# EAGLE design SparkFun_Optical_Tracking_Odometry_Sensor (EAGLE 9.6.2)
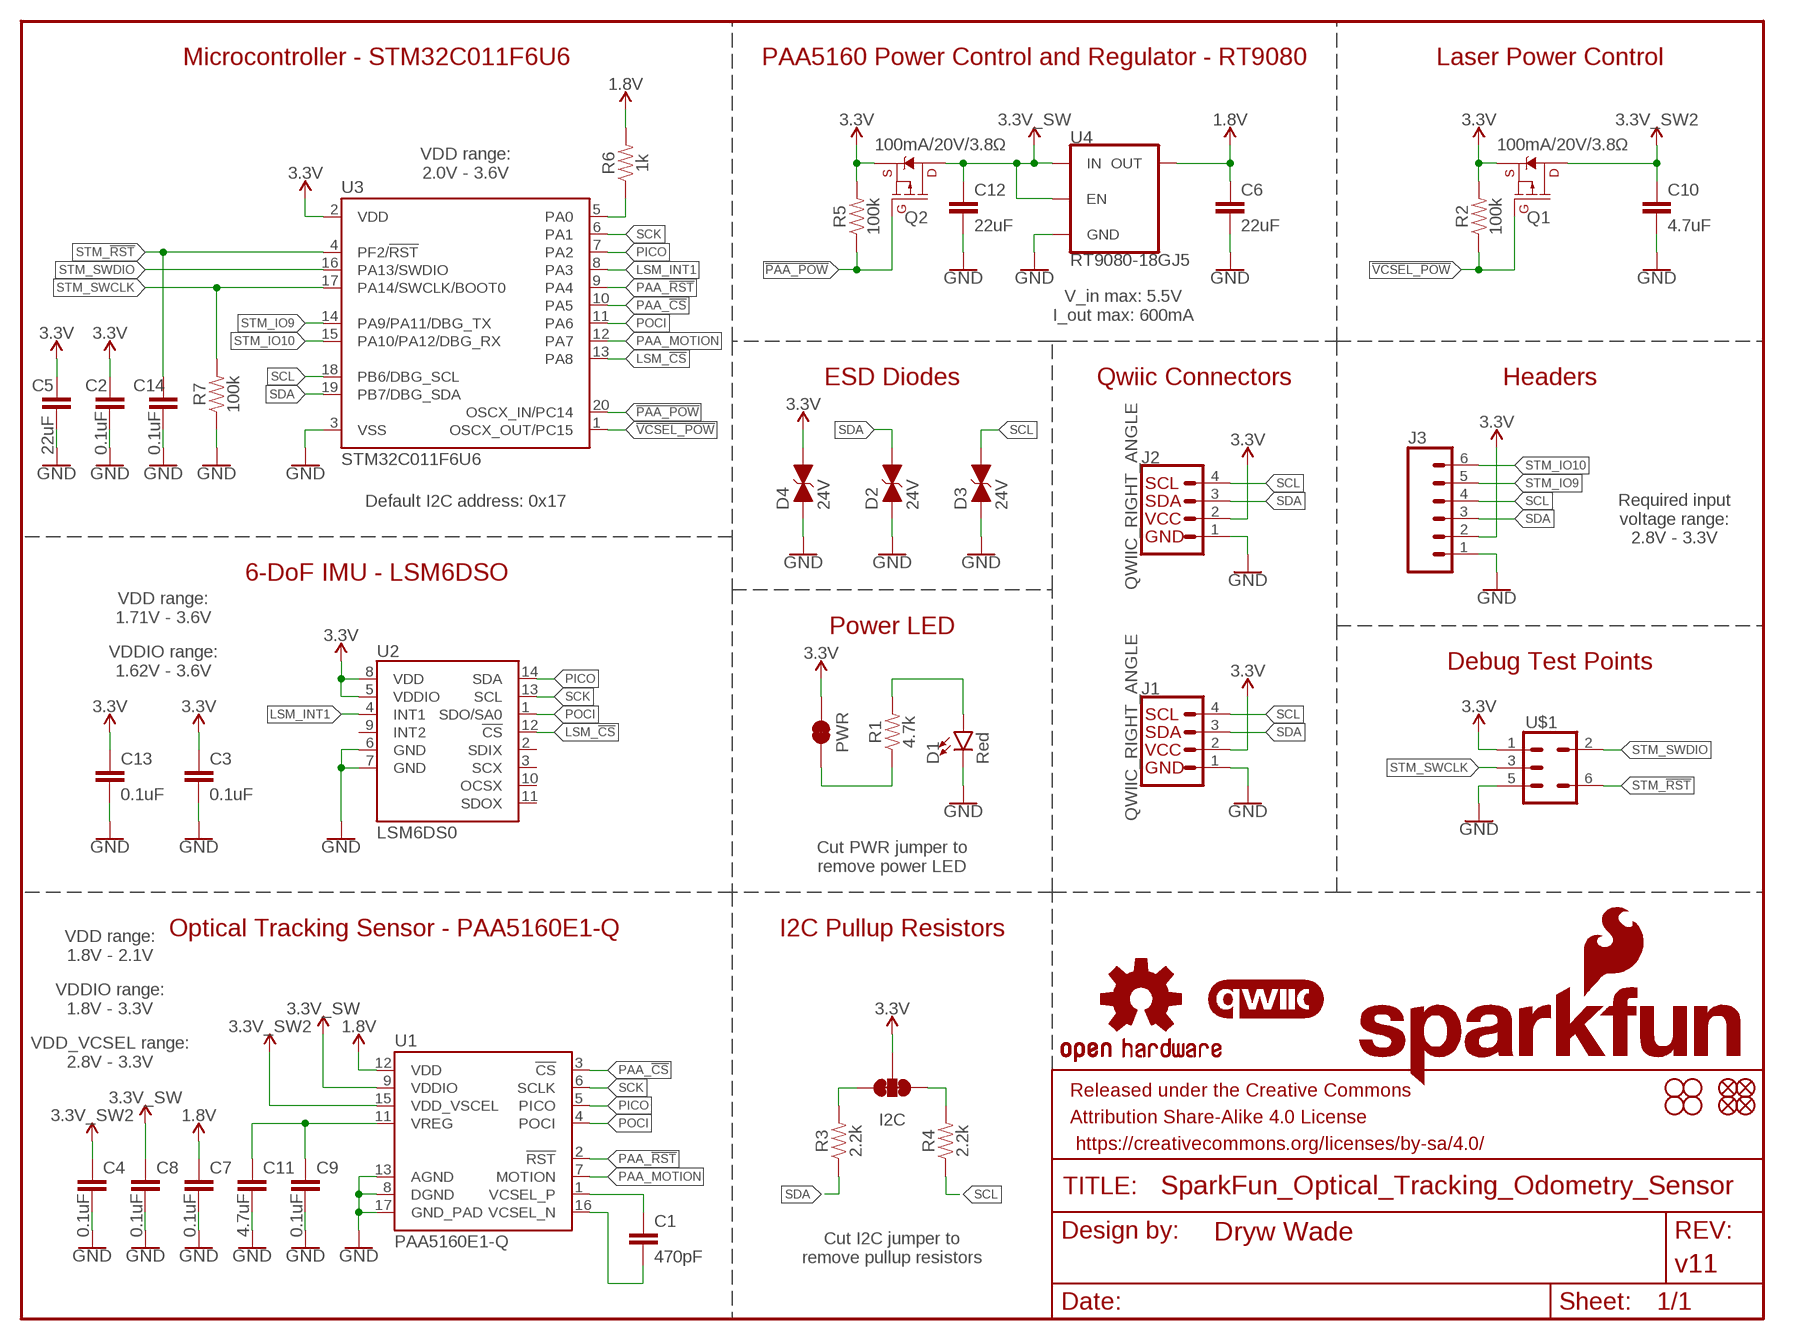
[diagram p0: schematic, sheet 1]

## Parts
C1  470pF  470PF-0603-50V-5%  [0603]
C2  0.1uF  0.1UF-0603-25V-(+80/-20%)  [0603]
C3  0.1uF  0.1UF-0603-25V-(+80/-20%)  [0603]
C4  0.1uF  0.1UF-0603-25V-(+80/-20%)  [0603]
C5  22uF  22UF-0603-6.3V-20%  [0603]
C6  22uF  22UF-0603-6.3V-20%  [0603]
C7  0.1uF  0.1UF-0603-25V-(+80/-20%)  [0603]
C8  0.1uF  0.1UF-0603-25V-(+80/-20%)  [0603]
C9  0.1uF  0.1UF-0603-25V-(+80/-20%)  [0603]
C10  4.7uF  4.7UF-0603-6.3V-(10%)  [0603]
C11  4.7uF  4.7UF-0603-6.3V-(10%)  [0603]
C12  22uF  22UF-0603-6.3V-20%  [0603]
C13  0.1uF  0.1UF-0603-25V-(+80/-20%)  [0603]
C14  0.1uF  0.1UF-0603-25V-(+80/-20%)  [0603]
D1  Red  LED-RED_0603-KB  [LED-0603]
D2  24V  DIODE_TVS  [0603]
D3  24V  DIODE_TVS  [0603]
D4  24V  DIODE_TVS  [0603]
FD1  FIDUCIAL1X2  [FIDUCIAL-1X2]
FD2  FIDUCIAL1X2  [FIDUCIAL-1X2]
FD3  FIDUCIAL1X2  [FIDUCIAL-1X2]
FD4  FIDUCIAL1X2  [FIDUCIAL-1X2]
FRAME1  FRAME-LETTER  [CREATIVE_COMMONS]
H1  STAND-OFF  [STAND-OFF]
H2  STAND-OFF  [STAND-OFF]
H3  STAND-OFF  [STAND-OFF]
H4  STAND-OFF  [STAND-OFF]
I2C  JUMPER-SMT_3_2-NC_TRACE_SILK  [SMT-JUMPER_3_2-NC_TRACE_SILK]
J1  QWIIC_RIGHT_ANGLE  QWIIC_CONNECTORJS-1MM  [JST04_1MM_RA]
J2  QWIIC_RIGHT_ANGLE  QWIIC_CONNECTORJS-1MM  [JST04_1MM_RA]
J3  CONN_06NO_SILK_NO_POP  [1X06_NO_SILK]
LOGO1  OSHW-LOGOS  [OSHW-LOGO-S]
LOGO2  QWIIC_LOGO_5MM  [QWIIC_5MM]
LOGO3  SFE_LOGO_NAME_FLAME.1_INCH  [SFE_LOGO_NAME_FLAME_.1]
PWR  JUMPER-SMT_2_NC_TRACE_SILK  [SMT-JUMPER_2_NC_TRACE_SILK]
Q1  100mA/20V/3.8Ω  MOSFET_PCH-RE1C001ZPTL  [SOT-416FL]
Q2  100mA/20V/3.8Ω  MOSFET_PCH-RE1C001ZPTL  [SOT-416FL]
R1  4.7k  4.7KOHM-0603-1/10W-1%  [0603]
R2  100k  100KOHM-0603-1/10W-1%  [0603]
R3  2.2k  2.2KOHM-0603-1/10W-1%  [0603]
R4  2.2k  2.2KOHM-0603-1/10W-1%  [0603]
R5  100k  100KOHM-0603-1/10W-1%  [0603]
R6  1k  1KOHM-0603-1/10W-1%  [0603]
R7  100k  100KOHM-0603-1/10W-1%  [0603]
U1  PAA5160E1-Q  [PAA5160E1-Q]
U2  LSM6DS0  LSM6DSO  [LGA14L]
U3  STM32C011F6U6  [STM32C011F6U6]
U4  RT9080-18GJ5  V_REG_RT9080-18GJ5  [SOT23-5]
U$1  SWD-5PIN  [PAD_05_03X2_TP_NO4]

## Nets
1.8V: C6.1 C7.1 R6.2 U1.12(VDD) U4.5(OUT)
3.3V: C2.1 C3.1 C5.1 C13.1 D4.2(C) I2C.2 J1.2 J2.2 J3.2 PWR.2 Q1.2(S) Q2.2(S) R2.2 R5.2 U2.5(VDDIO) U2.8(VDD) U3.2(VDD) U$1.1
3.3V_SW: C8.1 C12.1 Q2.3(D) U1.9(VDDIO) U4.1(IN) U4.3(EN)
3.3V_SW2: C4.1 C10.1 Q1.3(D) U1.15(VDD_VSCEL)
!PAA_POW!: Q2.1(G) R5.1 U3.20(OSCX_IN/PC14)
!VCSEL_POW!: Q1.1(G) R2.1 U3.1(OSCX_OUT/PC15)
GND: C2.2 C3.2 C4.2 C5.2 C6.2 C7.2 C8.2 C9.2 C10.2 C11.2 C12.2 C13.2 C14.2 D1.C D2.1(A) D3.1(A) D4.1(A) J1.1 J2.1 J3.1 R7.1 U1.8(DGND) U1.13(AGND) U1.17(GND_PAD) U2.6(GND) U2.7(GND) U3.3(VSS) U4.2(GND) U$1.5
LSM_!CS!: U2.12(!CS!) U3.13(PA8)
LSM_INT1: U2.4(INT1) U3.8(PA3)
N$1: PWR.1 R1.1
N$2: D1.A R1.2
N$3: C1.1 U1.1(VCSEL_P)
N$4: C1.2 U1.16(VCSEL_N)
N$5: I2C.3 R3.2
N$6: I2C.1 R4.2
N$7: C9.1 C11.1 U1.11(VREG)
N$8: R6.1 U3.5(PA0)
PAA_!CS!: U1.3(!CS!) U3.10(PA5)
PAA_!RST!: U1.2(!RST!) U3.9(PA4)
PAA_MOTION: U1.7(MOTION) U3.12(PA7)
PICO: U1.5(PICO) U2.14(SDA) U3.7(PA2)
POCI: U1.4(POCI) U2.1(SDO/SA0) U3.11(PA6)
SCK: U1.6(SCLK) U2.13(SCL) U3.6(PA1)
SCL: D3.2(C) J1.4 J2.4 J3.4 R4.1 U3.18(PB6/DBG_SCL)
SDA: D2.2(C) J1.3 J2.3 J3.3 R3.1 U3.19(PB7/DBG_SDA)
STM_!RST!: C14.1 U3.4(PF2/!RST!) U$1.6
STM_IO9: J3.5 U3.14(PA9/PA11/DBG_TX)
STM_IO10: J3.6 U3.15(PA10/PA12/DBG_RX)
STM_SWCLK: R7.2 U3.17(PA14/SWCLK/BOOT0) U$1.3
STM_SWDIO: U3.16(PA13/SWDIO) U$1.2
Unconnected: U2.2(SDIX) U2.3(SCX) U2.9(INT2) U2.10(OCSX) U2.11(SDOX)

## Notes on the sheet
- Microcontroller - STM32C011F6U6 | PAA5160 Power Control and Regulator - RT9080 | Laser Power Control
- VDD range:
  2.0V - 3.6V
- V_in max: 5.5V
  I_out max: 600mA
- ESD Diodes | Qwiic Connectors | Headers
- Default I2C address: 0x17
- Required input
  voltage range:
  2.8V - 3.3V
- 6-DoF IMU - LSM6DSO
- VDD range:
  1.71V - 3.6V
- Power LED
- VDDIO range:
  1.62V - 3.6V
- Debug Test Points
- Cut PWR jumper to
  remove power LED
- Optical Tracking Sensor - PAA5160E1-Q | I2C Pullup Resistors
- VDD range:
  1.8V - 2.1V
- VDDIO range:
  1.8V - 3.3V
- VDD_VCSEL range:
  2.8V - 3.3V
- Cut I2C jumper to
  remove pullup resistors

## Library data of the parts
C1 = SparkFun-Capacitors:470PF: 470pF ceramic capacitors A capacitor is a passive two-terminal electrical component used to store electrical energy temporarily in an electric field.; PROD_ID: CAP-07884
C2-C4 C7-C9 C13 C14 = SparkFun-Capacitors:0.1UF: 0.1µF ceramic capacitors A capacitor is a passive two-terminal electrical component used to store electrical energy temporarily in an electric field.; PROD_ID: CAP-00810
C5 C6 C12 = SparkFun-Capacitors:22UF: 22µF ceramic capacitors A capacitor is a passive two-terminal electrical component used to store electrical energy temporarily in an electric field.; PROD_ID: CAP-14464
C10 C11 = SparkFun-Capacitors:4.7UF: 4.7µF ceramic capacitors A capacitor is a passive two-terminal electrical component used to store electrical energy temporarily in an electric field.; PROD_ID: CAP-08280
D1 = SparkFun-LED:LED-RED: Red SMD LED Used in manufacturing of most products at SparkFun Packages: 0603 - KB - KingBright (DIO-17976) SMD 0603 package [Datasheet] <https://www.kingbrightusa.com/images/catalog/SPEC/APT1608SURCK.pdf> 0603 - (DIO-00819, has gone EOL) SMD 0603 package 0603 SMART - SMD 0603 SMART package ( more efficient and expensive)[Product Link] <http://www.osram-os.com/Graphics/XPic2/00077099_0.pdf> 1206 - SMD1206 package [Product Link] <https://www.sparkfun.com/datasheets/DevTools/LilyPad/Q150OVS4.pdff> SparkFun Products: Pro Mini 328 -5V <https://www.sparkfun.com/products/821> RedBoard <https://www.sparkfun.com/products/12757> IOIO-OTG <https://www.sparkfun.com/products/13613>; PROD_ID: DIO-17976
D2-D4 = SparkFun-DiscreteSemi:DIODE_TVS; PROD_ID: DIO-14502
FD1-FD4 = SparkFun-Aesthetics:FIDUCIAL: Fiducial Alignment Points Point-of-reference for pick-and-place machines and other optical instruments.
FRAME1 = SparkFun-Aesthetics:FRAME-LETTER: Schematic Frame - Letter Standard 8.5x11 US Letter frame; DESIGNER: Dryw Wade; REV: v11
H1-H4 = SparkFun-Hardware:STAND-OFF: Stand Off Drill holes for mechanically mounting via screws, standoffs, etc. Note: Use the keepout ring to avoid running the screw head into surrounding components. Variant Overviews STAND-OFF - Mechanical footprint for a #4 phillips button head screw. STAND-OFF-TIGHT - Mechanical footprint for a #4 phillips button head screw, Example SparkFun Products Screw - Phillips Head (1/4", 4-40, 10 pack) <https://www.sparkfun.com/products/10453> (PRT-10453) Screw - Phillips Head (1/2", 4-40, 10 pack) <https://www.sparkfun.com/products/10452> (PRT-10452) Screw - Phillips Head (3/4", 4-40, 10 pack) <https://www.sparkfun.com/products/10451> (PRT-10451) Screw - Phillips Head (1", 4-40, 10 pack) <https://www.sparkfun.com/products/10450> (PRT-10450)
I2C = SparkFun-Jumpers:JUMPER-SMT_3_2-NC_TRACE: Normally closed trace jumper (2 of 2 connections) This jumper has a trace between all three pads so they are normally closed (NC). Use a razor knife to open the connection(s). For best results follow the IPC guidelines for cutting traces: Cutout at least 0.063 mm (0.005 in). Remove all loose material to clean up the cut area. Seal the cut with an approved epoxy. Reapply solder to reclose the connection(s).
J1 J2 = SparkFun-Connectors:QWIIC_CONNECTOR: SparkFun I2C Standard Qwiic Connector An SMD 1mm pitch JST connector makes it easy and quick (get it? Qwiic?) to connect I2C devices to each other. The Qwiic system <http://www.sparkfun.com/qwiic> enables fast and solderless connection between popular platforms and various sensors and actuators. We carry 200mm <https://www.sparkfun.com/products/14204>, 100mm <https://www.sparkfun.com/products/14205>, 50mm <https://www.sparkfun.com/products/14206>, and breadboard friendly <https://www.sparkfun.com/products/14207> Qwiic cables. We also offer 10 pcs strips <https://www.sparkfun.com/products/14323> the SMD connectors.; PROD_ID: CONN-13694
J3 = SparkFun-Connectors:CONN_06: Multi connection point. Often used as Generic Header-pin footprint for 0.1 inch spaced/style header connections On any of the 0.1 inch spaced packages, you can populate with these: Break Away Headers - Straight <https://www.sparkfun.com/products/116> (PRT-00116) Break Away Male Headers - Right Angle <https://www.sparkfun.com/products/553> (PRT-00553) Female Headers <https://www.sparkfun.com/products/115> (PRT-00115) Break Away Headers - Machine Pin <https://www.sparkfun.com/products/117> (PRT-00117) Break Away Female Headers - Swiss Machine Pin <https://www.sparkfun.com/products/743> (PRT-00743) Arduino Stackable Header - 6 Pin <https://www.sparkfun.com/products/9280> (PRT-09280) Screw Terminals 2.54mm Pitch (6-Pin) <https://www.sparkfun.com/products/16499> (PRT-16499) For SCREWTERMINALS and SPRING TERMINALS visit here: Screw Terimnals on SparkFun.com <https://www.sparkfun.com/search/results?term=Screw+Terminals> (5mm/3.5mm/2.54mm spacing) This device is also useful as a general connection point to wire up your design to another part of your project. Our various solder wires solder well into these plated through hole pads. Hook-Up Wire - Assortment (Stranded, 22 AWG) <https://www.sparkfun.com/products/11375> (PRT-11375) Hook-Up Wire - Assortment (Solid Core, 22 AWG) <https://www.sparkfun.com/products/11367> (PRT-11367) View the entire wire category on our website here <https://www.sparkfun.com/categories/141>
LOGO1 = SparkFun-Aesthetics:OSHW-LOGO: Open-Source Hardware (OSHW) Logo This logo indicates the piece of hardware it is found on incorporates a OSHW license and/or adheres to the definition of open source hardware found here: http://freedomdefined.org/OSHW
LOGO2 = SparkFun-Aesthetics:QWIIC_LOGO: Qwiic Logos for placement on schematic and PCB. The 5.5mm silk logo is best for placing next to Qwiic connector.
LOGO3 = SparkFun-Aesthetics:SFE_LOGO_NAME_FLAME: SparkFun Font Logo w/ Flame This is the SparkFun full logo. The logo on the schematic will always be the same size; the package variant is the height of the flame part of the logo. Default layer for the logo on the board is tSilk.
PWR = SparkFun-Jumpers:JUMPER-SMT_2_NC_TRACE: Normally closed trace jumper This jumper has a trace between two pads so it's normally closed (NC). Use a razor knife to open the connection. For best results follow the IPC guidelines for cutting traces: Cutout at least 0.063 mm (0.005 in). Remove all loose material to clean up the cut area. Seal the cut with an approved epoxy. Reapply solder to reclose the connection.
Q1 Q2 = SparkFun-DiscreteSemi:MOSFET_PCH: P-channel MOSFETs Voltage controlled devices that allow control of high current outputs. SparkFun Products: SparkFun ESP32 Thing <https://www.sparkfun.com/products/13907> SparkFun ESP8266 Thing <https://www.sparkfun.com/products/13231> SparkFun Pi Servo HAT V2 <https://www.sparkfun.com/products/15316> DMG2305UX-7 (20V/4.2A/SOT23-3); PROD_ID: TRANS-15421
R1 = SparkFun-Resistors:4.7KOHM: 4.7kΩ resistor A resistor is a passive two-terminal electrical component that implements electrical resistance as a circuit element. Resistors act to reduce current flow, and, at the same time, act to lower voltage levels within circuits. - Wikipedia; PROD_ID: RES-07857
R2 R5 R7 = SparkFun-Resistors:100KOHM: 100kΩ resistor A resistor is a passive two-terminal electrical component that implements electrical resistance as a circuit element. Resistors act to reduce current flow, and, at the same time, act to lower voltage levels within circuits. - Wikipedia; PROD_ID: RES-07828
R3 R4 = SparkFun-Resistors:2.2KOHM: 2.2kΩ resistor A resistor is a passive two-terminal electrical component that implements electrical resistance as a circuit element. Resistors act to reduce current flow, and, at the same time, act to lower voltage levels within circuits. - Wikipedia; PROD_ID: RES-08272
R6 = SparkFun-Resistors:1KOHM: 1kΩ resistor A resistor is a passive two-terminal electrical component that implements electrical resistance as a circuit element. Resistors act to reduce current flow, and, at the same time, act to lower voltage levels within circuits. - Wikipedia; PROD_ID: RES-07856
U1 = Optical_Tracking_Odometry_Sensor:PAA5160E1-Q; PROD_ID: IC-21320
U2 = SparkFun-Sensors:LSM6DSO: The LSM6DSO is a system-in-package featuring a high-performance 3-axis digital accelerometer and 3-axis digital gyroscope.; PROD_ID: IC-15837
U3 = Optical_Tracking_Odometry_Sensor:STM32C011F6U6; PROD_ID: IC-21321
U4 = SparkFun-IC-Power:V_REG_RT9080-18GJ5: RT9080-18GJ5 Low-Dropout Linear Regulator The RT9080 is a low-dropout (LDO) voltage regulators with enable function that operates from 1.2V to 5.5V. It provides up to 600mA of output current and offers low-power operation in miniaturized packaging. The features of low quiescent current as low as 2μA and almost zero disable current is ideal for powering the battery equipment to a longer service life. The RT9080 is stable with the ceramic output capacitor over its wide input range from 1.2V to 5.5V and the entire range of output load current (0mA to 600mA). The output for this LDO is 1.8V.; PROD_ID: VREG-21045
U$1 = SparkFun-Connectors:SWD-5PIN: 5-pin SWD connector Test-point based header for SWD. Pin 1 - PWR Pin 2 - SWDIO Pin 3 - SWCLK Pin 4 - NC Pin 5 - GND Pin 6 - RESET

## Board
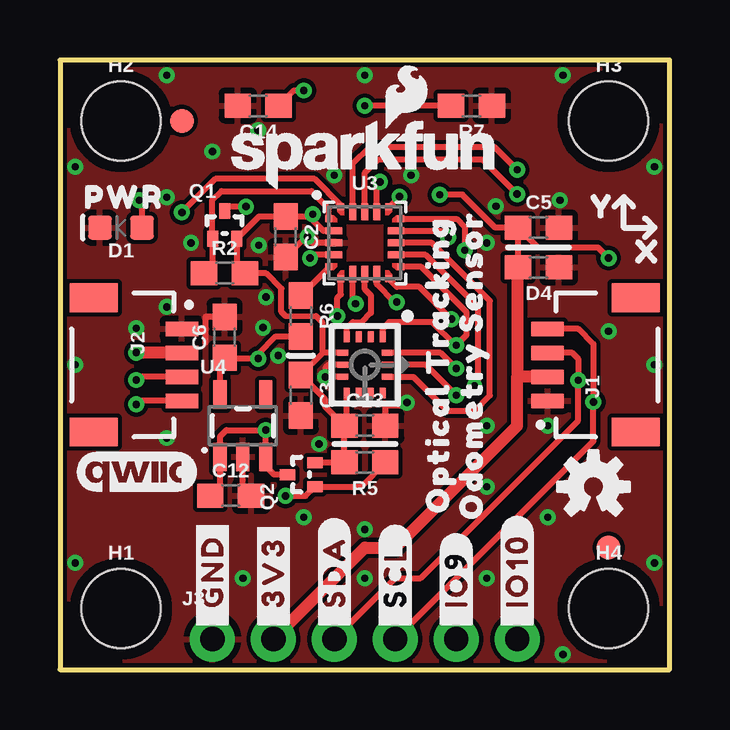
[diagram p1: board, top side]
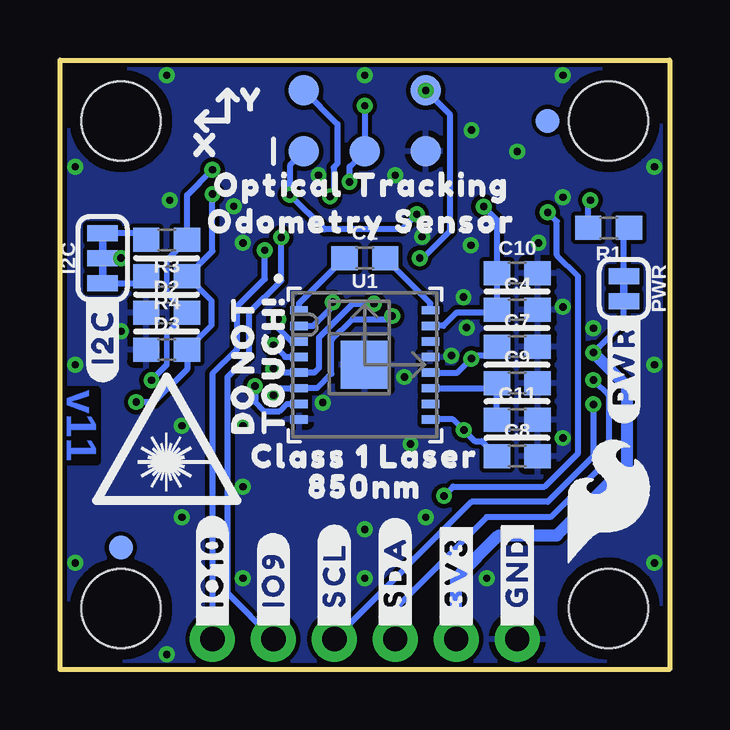
[diagram p2: board, bottom side, seen from below]

Size 25.4 x 25.4 mm. Coordinates in mm from the lower left corner, seen from the top.
Outline: 0,0 25.4,0 25.4,25.4 0,25.4 0,0
Copper layers (1*16): Top 0.035mm / dielectric 1.5mm / Bottom 0.035mm
Design rules "SparkFun-2-Layer-General-JLCPCB": minimum track width 7mil, minimum drill 0.3mm, track to track 7mil, track to pad 7mil, pad to pad 7mil, via to via 7mil, smd to smd 7mil, copper to edge 7mil, drill to drill 7mil, minimum pad ring 7mil, minimum via ring 7mil, stop-mask expansion 3mil, vias tented up to drill 25mil, thermal gap 10mil
tRestrict: area 6.7,16.1 to 7,16.3

### Footprints (pad centres in the part's own frame; a part is rotated, then mirrored left to right if it is on the bottom)
0603 = smd 1.1 x 1: 1 -0.85,0; 2 0.85,0
LED-0603 = smd 1 x 1: A -0.877,0; C 0.877,0
FIDUCIAL-1X2 = smd 1 x 1: 1 0,0
STAND-OFF = hole 3.302: 0,0
SMT-JUMPER_3_2-NC_TRACE_SILK = smd 0.66 x 1.27: 1 -1.041,0; 2 0,0; 3 1.041,0
JST04_1MM_RA = smd 0.6 x 1.35: 1 -1.5,0; 2 -0.5,0; 3 0.5,0; 4 1.5,0 | smd 1.2 x 2: NC1 2.8,-3.675; NC2 -2.8,-3.675
1X06_NO_SILK = drill 1.016 pad 1.88: 1 0,0; 2 2.54,0; 3 5.08,0; 4 7.62,0; 5 10.16,0; 6 12.7,0
SMT-JUMPER_2_NC_TRACE_SILK = smd 0.66 x 1.27: 1 -0.521,0; 2 0.521,0
SOT-416FL = smd 0.46 x 0.65: 1 -0.5,-1.1; 2 0.5,-1.1; 3 0,0.05
PAA5160E1-Q = smd 0.73 x 0.35: 1 -2.735,2.275; 2 -2.735,1.625; 3 -2.735,0.975; 4 -2.735,0.325; 5 -2.735,-0.325; 6 -2.735,-0.975; 7 -2.735,-1.625; 8 -2.735,-2.275; 9 2.735,-2.275; 10 2.735,-1.625; 11 2.735,-0.975; 12 2.735,-0.325; 13 2.735,0.325; 14 2.735,0.975; 15 2.735,1.625; 16 2.735,2.275 | smd 2 x 2: 17 0,0
LGA14L = smd 0.45 x 0.25: 1 -1.175,0.75; 2 -1.175,0.25; 3 -1.175,-0.25; 4 -1.175,-0.75; 8 1.175,-0.75; 9 1.175,-0.25; 10 1.175,0.25; 11 1.175,0.75 | smd 0.25 x 0.45: 5 -0.5,-0.925; 6 0,-0.925; 7 0.5,-0.925; 12 0.5,0.925; 13 0,0.925; 14 -0.5,0.925
STM32C011F6U6 = smd 0.3 x 0.3: 1 -1.5,1; 5 -1.5,-1; 6 -1,-1.5; 10 1,-1.5; 11 1.5,-1; 15 1.5,1; 16 1,1.5; 20 -1,1.5 | smd 0.7 x 0.3: 2 -1.3,0.5; 3 -1.3,0; 4 -1.3,-0.5; 12 1.3,-0.5; 13 1.3,0; 14 1.3,0.5 | smd 0.3 x 0.7: 7 -0.5,-1.3; 8 0,-1.3; 9 0.5,-1.3; 17 0.5,1.3; 18 0,1.3; 19 -0.5,1.3
SOT23-5 = smd 0.55 x 1.2: 1 -0.95,-1.3; 2 0,-1.3; 3 0.95,-1.3; 4 0.95,1.3; 5 -0.95,1.3
PAD_05_03X2_TP_NO4 = smd 1.27 x 1.27: 1 -2.54,-1.27; 2 -2.54,1.27; 3 0,-1.27; 5 2.54,-1.27; 6 2.54,1.27

### Placement (x,y rotation side)
C1  12.7,17.14 0 bottom
C2  9.4,18.03 270 top
C3  10.03,11.43 270 top
C4  6.35,14.99 0 bottom
C5  19.94,18.41 0 top
C6  6.86,13.84 90 top
C7  6.35,13.46 0 bottom
C8  6.35,8.89 0 bottom
C9  6.35,11.94 0 bottom
C10  6.35,16.51 0 bottom
C11  6.35,10.41 0 bottom
C12  7.11,7.24 0 top
C13  12.7,10.16 0 top
C14  8.26,23.5 180 top
D1  2.54,18.41 180 top
D2  20.95,14.86 0 bottom
D3  20.95,13.34 0 bottom
D4  19.94,16.76 180 top
FD1  5.08,22.86 0 bottom
FD2  5.08,22.86 0 top
FD3  22.86,5.08 0 bottom
FD4  22.86,5.08 0 top
FRAME1  64.77,-8.89 0 top  (outside the outline)
H1  2.54,2.54 0 top
H2  2.54,22.86 0 top
H3  22.86,22.86 0 top
H4  22.86,2.54 0 top
I2C  23.62,17.14 90 bottom
J1  20.32,12.7 90 top
J2  5.08,12.7 270 top
J3  6.35,1.27 0 top
LOGO1  22.23,7.62 0 top
LOGO2  3.17,8.26 0 top
LOGO3  12.7,21.46 0 top
PWR  1.91,15.88 270 bottom
Q1  6.86,19.05 0 top
Q2  9.53,8.13 90 top
R1  2.54,18.41 180 bottom
R2  6.86,16.51 0 top
R3  20.95,17.91 180 bottom
R4  20.95,16.38 180 bottom
R5  12.7,8.64 180 top
R6  10.03,14.73 270 top
R7  17.14,23.5 180 top
U1  12.7,12.7 0 bottom
U2  12.7,12.7 270 top
U3  12.7,17.78 0 top
U4  7.62,10.16 0 top
U$1  12.7,22.86 0 bottom
U$2  [#_GND#0]  6.35,1.52 90 top
U$3  [#_3V3#0]  8.89,1.52 90 top
U$4  [#_SDA#0]  11.43,1.52 90 top
U$5  [#_SCL#0]  13.97,1.52 90 top
U$6  [CLASS_1_LASER0]  12.7,8.89 0 bottom
U$7  [#_IO10#0]  19.05,1.52 90 top
U$8  [#_GND#0]  6.35,1.52 90 bottom
U$9  [#_3V3#0]  8.89,1.52 90 bottom
U$10  [#_SDA#0]  11.43,1.52 90 bottom
U$11  [#_SCL#0]  13.97,1.52 90 bottom
U$12  [#_IO9#0]  16.51,1.52 90 top
U$14  [OPTICAL_TRACKING0]  12.83,20.19 0 bottom
U$15  [ODOMETRY_SENSOR0]  12.83,18.67 0 bottom
U$16  [OPTICAL_TRACKING0]  15.75,12.7 90 top
U$17  [ODOMETRY_SENSOR0]  17.14,12.7 90 top
U$18  [X0]  24.51,17.4 0 top
U$20  [#PWR#0]  1.91,14.99 90 bottom
U$21  [TOUCH##0]  16.51,12.7 90 bottom
U$22  [DO_NOT0]  17.78,12.7 90 bottom
U$23  [#_IO10#0]  19.05,1.52 90 bottom
U$24  [SFE_LOGO_FLAME_.2]  2.54,6.99 0 bottom
U$25  [PWR0]  2.67,19.68 0 top
U$26  [#I2C#0]  23.62,15.75 90 bottom
U$27  [ORDERING_INSTRUCTIONS]  36.83,50.8 0 top  (outside the outline)
U$28  [850NM0]  12.7,7.62 0 bottom
U$29  [Y0]  22.61,19.3 0 top
U$30  [X0]  19.3,21.84 0 bottom
U$31  [Y0]  17.4,23.75 0 bottom
U$32  [#_IO9#0]  16.51,1.52 90 bottom

### Tracks (layer width: path | path; a pad name or v marks a point on that pad's centre or on a via)
1.8V  (via drill 0.3)
  Top 0.254: U4.5 6.67,12.8 C6.1 6.89,12.96 v8.26,12.96 8.26,13.15 8.99,13.88 R6.2
  Bottom 0.254: C7.1 7.56,13.11 8.11,13.11 v8.26,12.96 8.84,12.38 U1.12
3.3V  (via drill 0.3)
  Top 0.229: 10.67,14.73 9.4,14.73
  Top 0.254: C13.1 11.95,10.26 U2.8 | 10.94,13.19 C3.1 11.05,11.26 11.05,10.96 C13.1 | 10.94,13.19 10.95,13.2 U2.5 | U3.2 10.97,18.28 10.53,18.72 v10.53,18.97 10.44,18.88 C2.1 8.29,18.88 Q1.2 7.36,16.86 R2.2 8.59,16.51 9.22,15.88 9.22,14.91 9.4,14.73 | 10.94,13.19 10.94,14.45 10.92,14.47 10.92,14.48 10.67,14.73 | Q2.2 10.63,8.64 R5.2 C13.1 | 19.05,16.73 D4.2 C5.1 | v22.86,17.14 22.42,17.59 19.91,17.59 C5.1 | C5.1 18.14,18.41 16.77,19.79 v15.82,19.79
  Top 0.508: J2.2 3.18,13.2 v3.17,13.21 | J3.2 12.7,5.08 13.97,5.08 19.05,10.16 19.05,12.2 | J1.2 19.05,12.2 | 19.05,16.73 19.05,12.2
  Bottom 0.254: v10.53,18.97 11.17,18.34 14.38,18.34 v15.82,19.79 15.82,21.01 U$1.1 | I2C.2 v22.86,17.14 | v3.17,13.21 1.91,14.48 PWR.2
  Bottom 0.508: J3.2 8.89,3.81 7.11,5.59 4.7,5.59 1.78,8.51 1.78,11.81 v3.17,13.21
3.3V_SW  (via drill 0.3)
  Top 0.254: C12.1 6.67,7.65 U4.1 6.67,9.72 6.93,9.98 v8.57,9.98 U4.3 8.57,8.48 8.92,8.13 Q2.3
  Bottom 0.254: C8.1 7.83,9.53 8.12,9.53 v8.57,9.98 9.02,10.43 U1.9
3.3V_SW2  (via drill 0.3)
  Top 0.254: Q1.3 7.05,19.29 v7.75,19.29
  Bottom 0.254: U1.15 9.42,14.32 8.87,14.88 7.3,14.88 C4.1 C10.1 7.2,18.74 v7.75,19.29
!PAA_POW!  (via drill 0.3)
  Top 0.254: U3.20 11.7,19.36 10.61,20.45 6.48,20.45 v5.08,19.05 | R5.1 12.54,7.63 Q2.1 10.24,7.24 v9.4,7.24
  Bottom 0.254: v5.08,19.05 4.7,18.67 4.7,17.27 3.81,16.38 3.81,9.02 5.21,7.62 9.02,7.62 v9.4,7.24
!VCSEL_POW!
  Top 0.254: U3.1 11.2,19.21 10.47,19.94 6.73,19.94 6.32,19.53 6.32,17.98 Q1.1 6.36,16.86 R2.1
GND  (via drill 0.3)
  Top 0.254: U2.7 v11.06,12.2 | v11.06,12.2 v11.05,12.19 | U2.6 11.18,12.7 11.06,12.57 v11.06,12.2 | U3.3 10.51,17.78 10.38,17.91 10.12,17.91 C2.2 | C12.2 7.62,7.58 U4.2 | C6.2 6.05,14.69 6.05,14.22 | 6.05,14.22 6.05,13.63 | J2.1 6.03,14.2 6.05,14.22 | v14.45,11.12 14.32,10.99 13.55,10.99 C13.2
  other vias: 9.09,13.08 4.45,15.11 4.45,9.65 3.17,14.22 8.59,15.52 8.46,14.25 10.79,9.4 5.46,17.78 8.28,17.68 20.32,10.16 17.78,7.62 17.78,10.16 17.78,3.81 20.32,6.35 17.78,17.78 22.86,14.1 18.16,19.3 20.83,19.56 11.43,20.6 4.45,19.68 14.63,20.6 10.16,6.35 20.95,24.77 24.77,20.95 20.95,0.64 24.77,4.45 0.64,4.45 24.77,12.7 0.64,12.7 0.64,20.95 4.45,24.77 12.7,24.77 12.7,3.81 12.7,5.84 10.31,18.03 7.62,3.81 8.26,22.48 6.35,21.59
  pour Top (isolate 0.178): 0,0 25.4,0 25.4,25.4 0,25.4
  pour Bottom (isolate 0.178): 25.4,0 0,0 0,25.4 25.4,25.4
LSM_!CS!
  Top 0.254: U2.12 14.72,12.2 16.13,10.79 17.27,10.79 17.91,11.43 17.91,15.37 15.49,17.78 U3.13
LSM_INT1
  Top 0.254: U2.4 11.95,14.22 12.2,14.48 12.57,14.48 12.95,14.86 12.95,15.59 12.7,15.85 U3.8
N$1
  Bottom 0.254: PWR.1 1.91,18.2 R1.1
N$2  (via drill 0.3)
  Top 0.254: v3.3,19.56 3.42,19.44 D1.A
  Bottom 0.254: R1.2 3.39,19.47 v3.3,19.56
N$3
  Bottom 0.254: U1.1 15.44,15.26 C1.1
N$4
  Bottom 0.254: U1.16 9.96,15.26 C1.2
N$5
  Bottom 0.254: R3.2 22.08,18.19 I2C.3
N$6
  Bottom 0.254: I2C.1 22.08,16.1 R4.2
N$7
  Bottom 0.254: U1.11 7.41,11.72 C9.1 C11.1
N$8
  Top 0.254: U3.5 11.2,16.75 R6.1
PAA_!CS!  (via drill 0.3)
  Top 0.254: v16.31,14.61 14.96,15.95 14.03,15.95 U3.10
  Bottom 0.254: v16.31,14.61 16.31,14.22 15.76,13.68 U1.3
PAA_!RST!  (via drill 0.3)
  Top 0.254: v14.03,15.31 13.94,15.31 13.2,16.05 U3.9
  Bottom 0.254: U1.2 14.84,14.32 14.03,15.13 v14.03,15.31
PAA_MOTION  (via drill 0.3)
  Top 0.254: v17.27,11.81 17.4,11.94 17.4,15.11 15.23,17.28 U3.12
  Bottom 0.254: v17.27,11.81 17.27,11.15 16.89,10.77 16.25,10.77 15.94,11.07 U1.7
PICO  (via drill 0.3)
  Top 0.254: v12.32,15.24 12.2,15.36 U3.7 | v16.51,12.55 15.86,13.2 U2.14
  Bottom 0.254: v12.32,15.24 13.21,15.24 14.61,13.84 14.61,12.57 14.8,12.38 U1.5 16.34,12.38 v16.51,12.55
POCI  (via drill 0.3)
  Top 0.254: U2.1 13.45,14.21 13.72,14.48 15.52,14.48 16.48,13.51 v16.51,13.51 16.94,13.95 16.94,14.88 15.05,16.78 U3.11
  Bottom 0.254: v16.51,13.51 16.02,13.03 U1.4
SCK  (via drill 0.3)
  Top 0.254: v16.51,11.43 15.24,12.7 U2.13 | v11.56,14.73 11.56,15.49 11.7,15.64 U3.6
  Bottom 0.254: v16.51,11.43 16.21,11.72 U1.6 14.69,11.72 14.1,12.32 14.1,13.72 13.21,14.61 11.68,14.61 v11.56,14.73
SCL  (via drill 0.3)
  Top 0.254: U3.18 12.7,20.7 13.23,21.23 17.62,21.23 v19.05,19.81 | J2.4 3.33,11.2 v3.17,11.05 | J1.4 21.59,14.2 22.23,13.56 v22.23,11.15 22.23,9.53 J3.4
  Bottom 0.254: v3.17,11.05 3.17,8.89 5.08,6.99 8.26,6.99 J3.4 | v22.23,11.15 21.46,11.15 20.11,12.51 D3.2 19.09,14.35 19.09,15.37 R4.1 19.05,17.44 v19.05,19.81
SDA  (via drill 0.3)
  Top 0.254: U3.19 12.2,21.09 12.88,21.77 18.11,21.77 v19.05,20.83 | J2.3 3.31,12.2 v3.17,12.06 | J3.3 13.97,3.81 15.03,3.81 21.59,10.38 v21.59,12.06 21.59,12.95 21.34,13.2 J1.3
  Bottom 0.229: 20.95,14.01 20.95,12.69 v21.59,12.06 | 20.95,17.06 20.95,15.71
  Bottom 0.254: v3.17,12.06 2.54,11.43 2.54,8.76 4.95,6.35 7.62,6.35 11.43,2.54 J3.3 | 20.95,14.01 D2.2 20.95,15.71 | 20.95,17.06 R3.1 20.11,19.77 v19.05,20.83
STM_!RST!  (via drill 0.3)
  Top 0.254: U3.4 10.55,17.28 v10.41,17.14 | U$1.6 9.74,24.13 C14.1
  Bottom 0.254: v10.41,17.14 10.29,17.14 9.14,18.29 9.14,23.11 U$1.6
  other vias: 10.16,24.13
STM_IO9  (via drill 0.3)
  Top 0.254: U3.14 15.86,18.28 16.13,18.01 v16.18,18.01
  Bottom 0.254: v16.18,18.01 16.18,16.2 17.53,14.86 17.53,13.08 18.41,12.19 18.41,3.17 J3.5
STM_IO10  (via drill 0.3)
  Top 0.254: U3.15 16.53,18.78 16.87,18.44 v16.87,17.48
  Bottom 0.254: v16.87,17.48 16.87,16.28 18.03,15.11 18.03,13.34 19.05,12.32 J3.6
STM_SWCLK  (via drill 0.3)
  Top 0.254: U3.17 13.2,20.18 v13.34,20.32 | R7.2 v12.7,23.5
  Bottom 0.254: v13.34,20.32 13.34,20.95 U$1.3 v12.7,23.5
STM_SWDIO  (via drill 0.3)
  Top 0.254: U3.16 13.72,19.28 v14.15,19.71
  Bottom 0.254: v14.15,19.71 13.99,19.86 13.99,20.93 13.84,21.08 13.84,22.73 U$1.2

### Text on the board
Bottom: v11
Measures: Units: inches
tDocu: 2-layer / 1oz copper / Board thickness: 1.6mm / Material: TG135-140 / Soldermask: Red / Silkscreen: White / Surface Finish: Lead-Free HASL | Dryw Wade